# EAGLE design board_v2 (EAGLE 8.7.0)
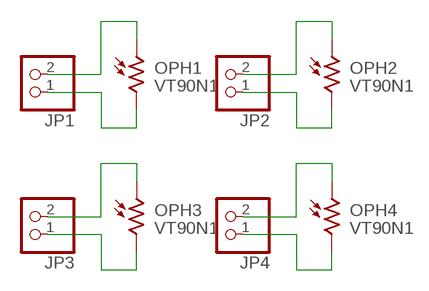
[diagram p0: schematic, sheet 1]

## Parts
JP1  PINHD-1X2  [1X02]
JP2  PINHD-1X2  [1X02]
JP3  PINHD-1X2  [1X02]
JP4  PINHD-1X2  [1X02]
OPH1  VT90N1  [VT900]
OPH2  VT90N1  [VT900]
OPH3  VT90N1  [VT900]
OPH4  VT90N1  [VT900]

## Nets
N$1: JP1.2 OPH1.1
N$2: JP1.1 OPH1.2
N$3: JP2.2 OPH2.1
N$4: JP2.1 OPH2.2
N$5: JP3.2 OPH3.1
N$6: JP3.1 OPH3.2
N$7: JP4.2 OPH4.1
N$8: JP4.1 OPH4.2

## Library data of the parts
JP1-JP4 = pinhead:PINHD-1X2: PIN HEADER
OPH1-OPH4 = photo-elements:VT9: Photoconductive Cell VT900 Series Source: http://optoelectronics.perkinelmer.com/content/Datasheets/DTS_vt900seriesdatasheet.pdf

## Board
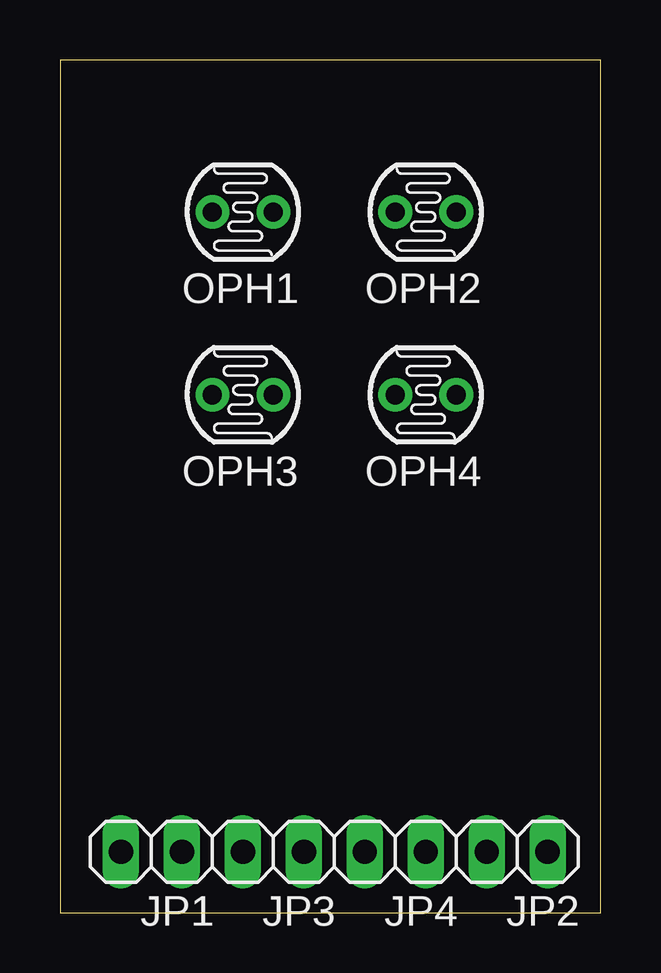
[diagram p1: board, top side]
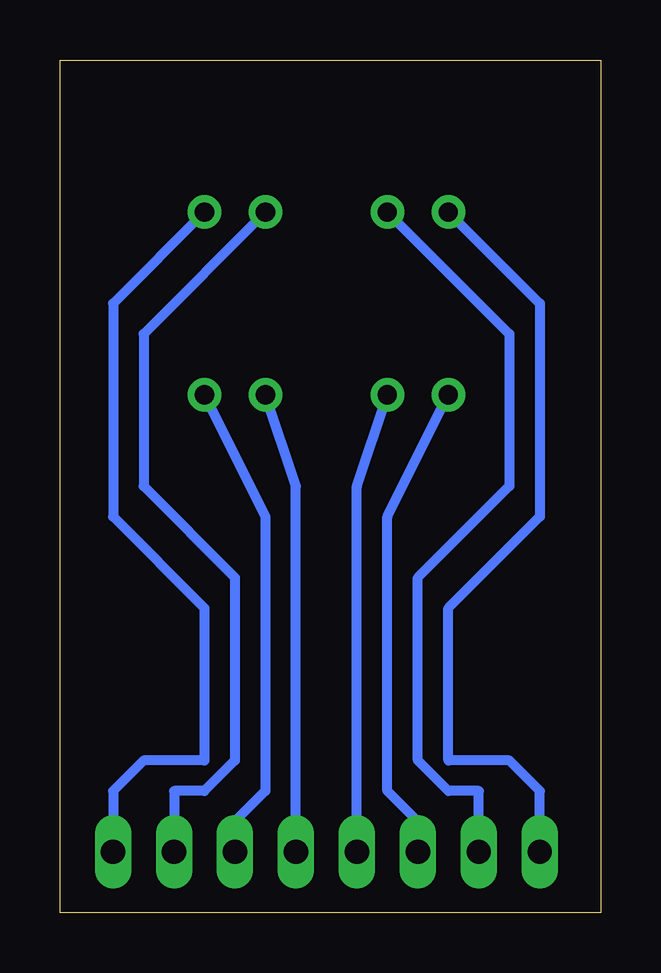
[diagram p2: board, bottom side, seen from below]

Size 22.53 x 35.55 mm. Coordinates in mm from the lower left corner, seen from the top.
Outline: 0,0 22.53,0 22.53,35.55 0,35.55 0,0
Copper layers (1*16): Top 0.035mm / dielectric 1.5mm / Bottom 0.035mm
Design rules "default": minimum track width 6mil, minimum drill 0.35mm, track to track 6mil, track to pad 6mil, pad to pad 6mil, via to via 6mil, smd to smd 6mil, copper to edge 40mil, drill to drill 6mil, minimum pad ring 10mil, minimum via ring 8mil, stop-mask expansion 4mil, vias tented up to drill 0mil, thermal gap 10mil

### Footprints (pad centres in the part's own frame; a part is rotated, then mirrored left to right if it is on the bottom)
1X02 = drill 1.016 long: 1 -1.27,0; 2 1.27,0
VT900 = drill 0.8 pad 1.4: 1 -1.27,0; 2 1.27,0

### Placement (x,y rotation side)
JP1  3.81,2.54 180 top
JP2  19.05,2.54 180 top
JP3  8.89,2.54 180 top
JP4  13.97,2.54 180 top
OPH1  7.62,29.21 0 top
OPH2  15.24,29.21 0 top
OPH3  7.62,21.59 0 top
OPH4  15.24,21.59 0 top

### Tracks (layer width: path | path; a pad name or v marks a point on that pad's centre or on a via)
N$1
  Bottom 0.406: OPH1.1 2.54,25.4 2.54,16.51 6.35,12.7 6.35,6.35 3.81,6.35 2.54,5.08 JP1.2
N$2
  Bottom 0.406: OPH1.2 3.81,24.13 3.81,17.78 7.62,13.97 7.62,6.35 6.35,5.08 5.08,5.08 JP1.1
N$3
  Bottom 0.406: OPH2.1 19.05,24.13 19.05,17.78 15.24,13.97 15.24,6.35 16.51,5.08 17.78,5.08 JP2.2
N$4
  Bottom 0.406: OPH2.2 20.32,25.4 20.32,16.51 16.51,12.7 16.51,6.35 19.05,6.35 20.32,5.08 JP2.1
N$5
  Bottom 0.406: OPH3.1 8.89,16.51 8.89,5.08 7.62,3.81 JP3.2
N$6
  Bottom 0.406: OPH3.2 10.16,17.78 JP3.1
N$7
  Bottom 0.406: OPH4.1 12.7,17.78 JP4.2
N$8
  Bottom 0.406: OPH4.2 13.97,16.51 13.97,5.08 15.24,3.81 JP4.1